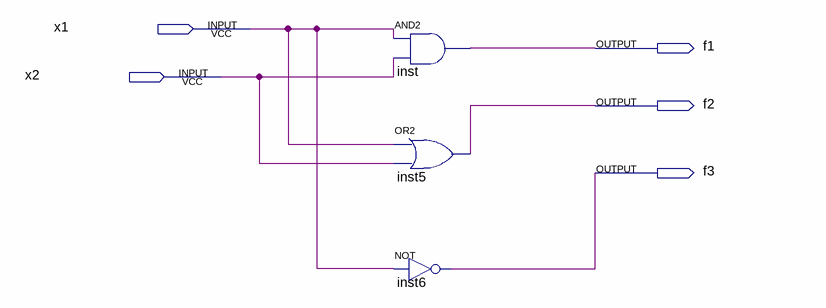
[diagram p0: schematic sheet]
// Quartus schematic PortaLogicas.bdf as structural Verilog: 3 symbols, 5 pins
module PortaLogicas (
  input  x1,
  input  x2,
  output f1,
  output f2,
  output f3
);

  and inst (f1, x1, x2);
  or inst5 (f2, x1, x2);
  not inst6 (f3, x1);
endmodule
